# EAGLE design arduino_due_v.1 (EAGLE 8.2.0)
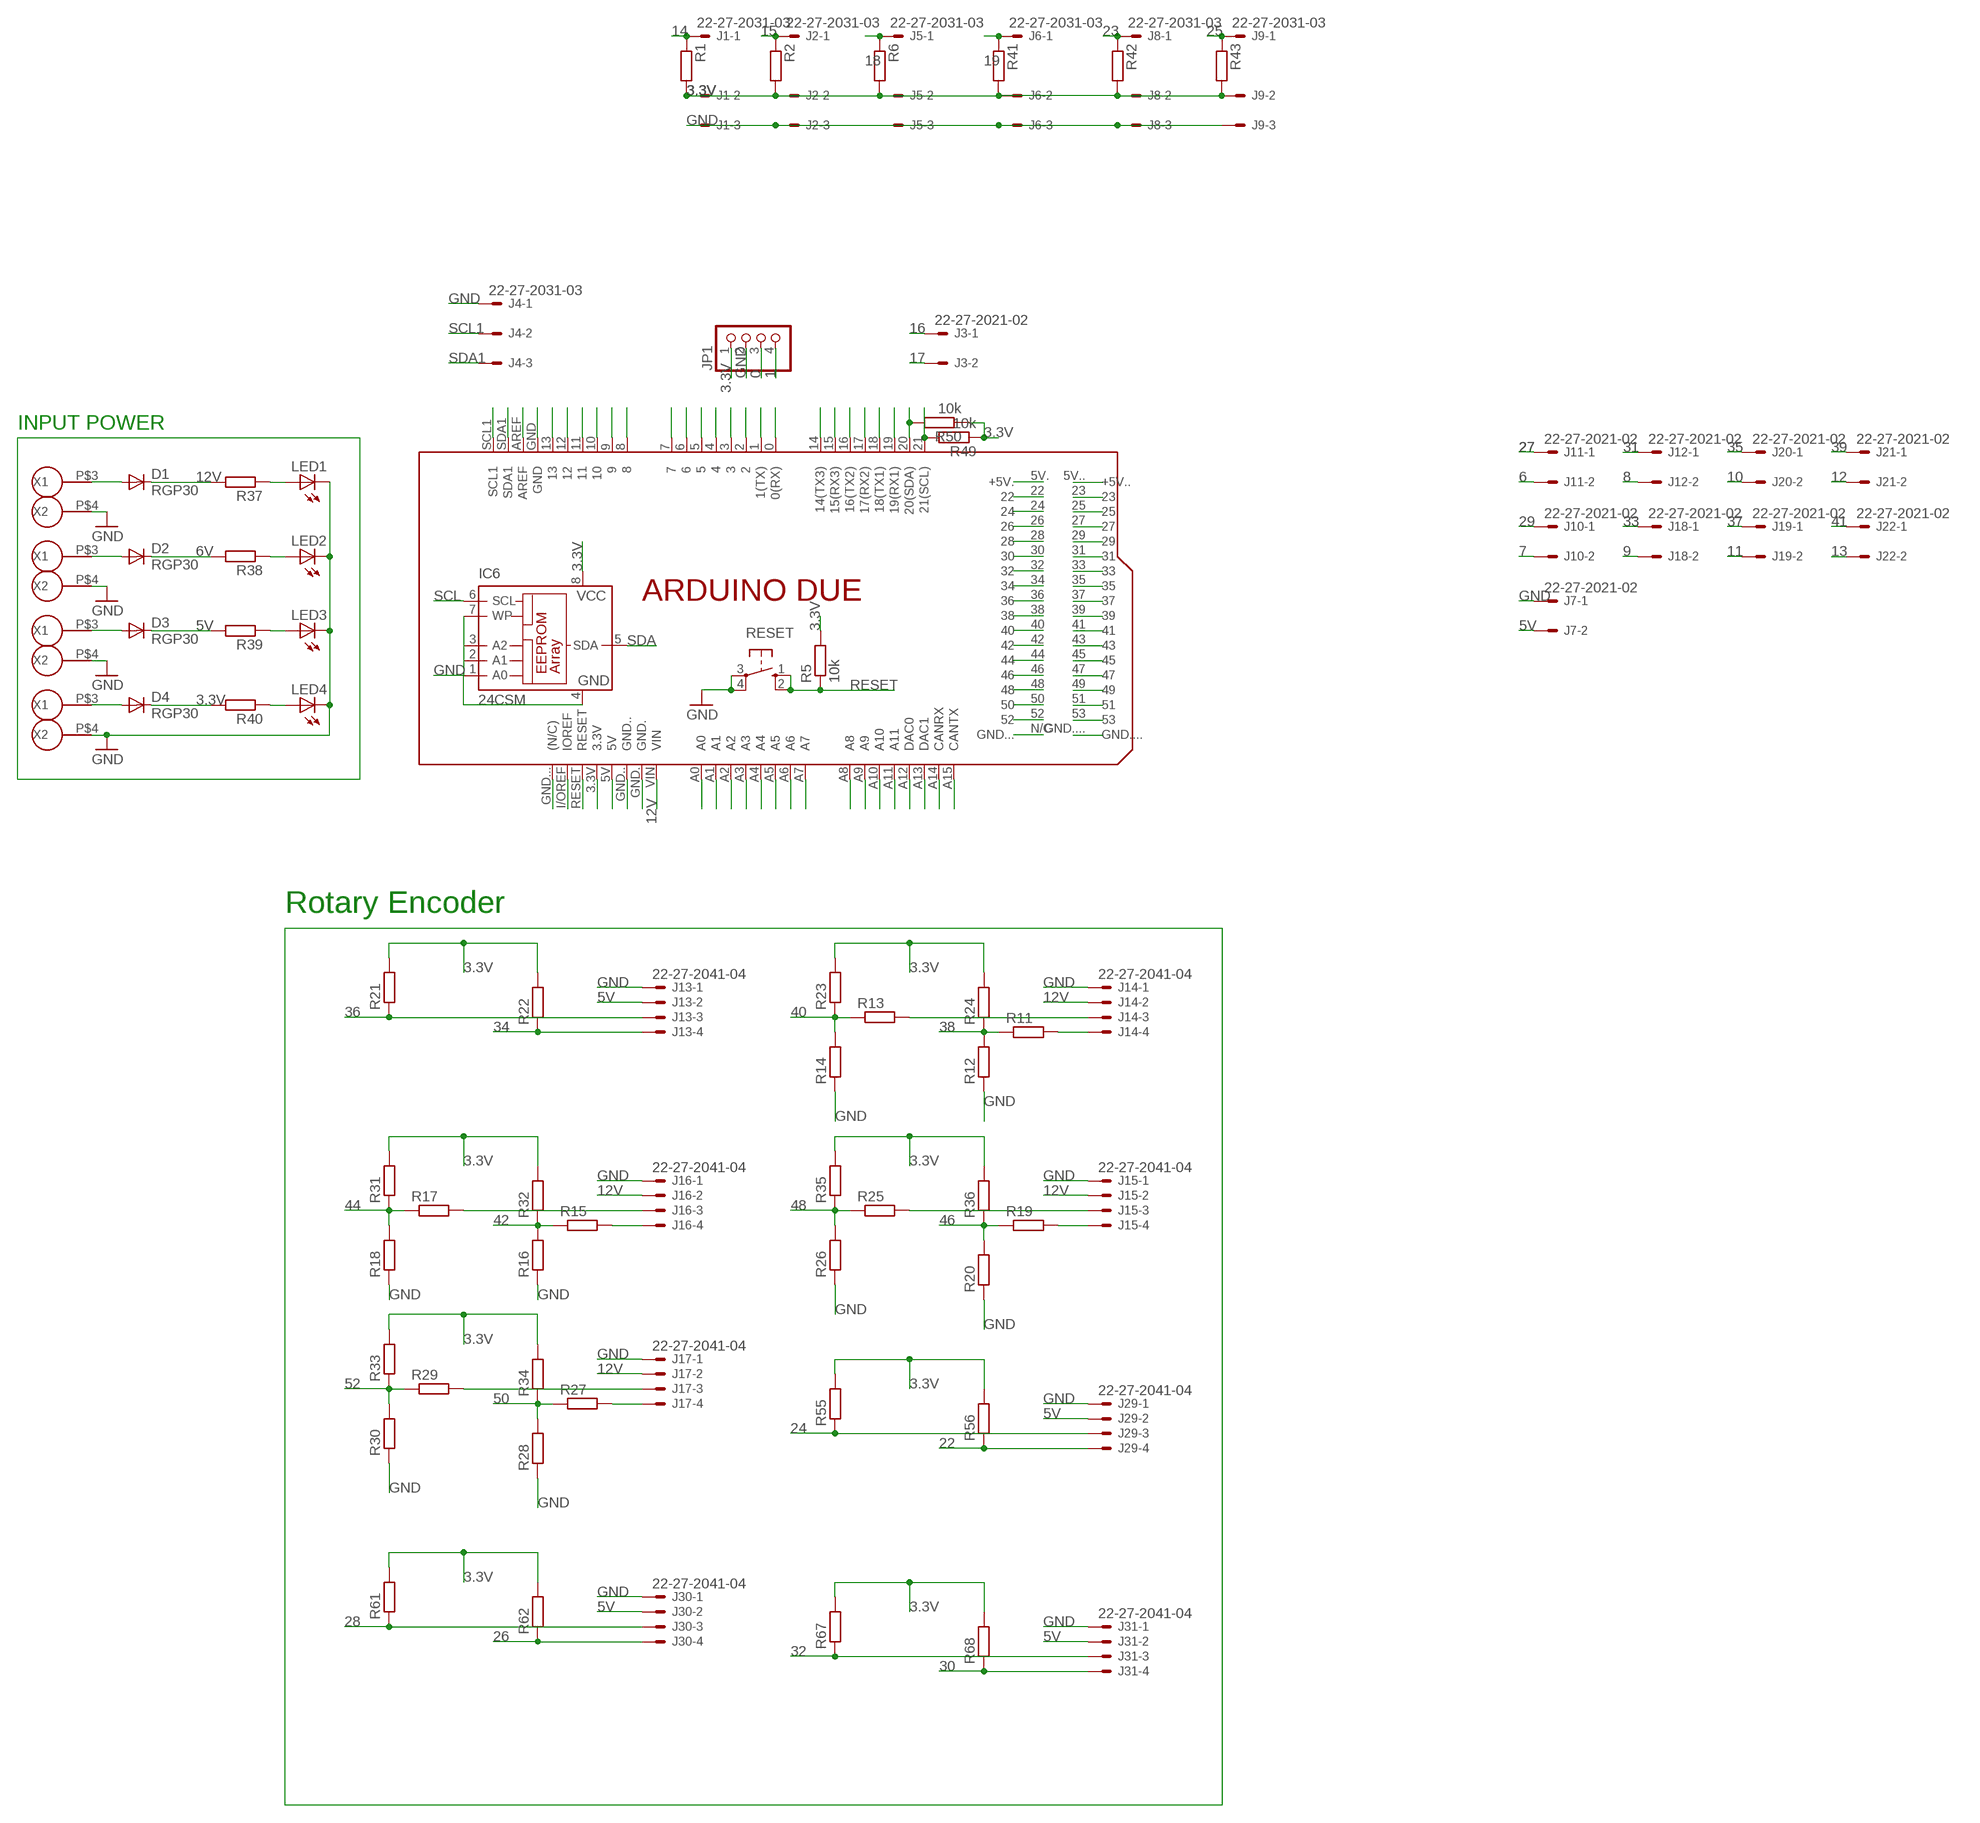
[diagram p0: schematic, sheet 1]

## Parts
D1  RGP30  [DO201-15]
D2  RGP30  [DO201-15]
D3  RGP30  [DO201-15]
D4  RGP30  [DO201-15]
IC6  24CSM  24C02CSM  [SO-08M]
J1  22-27-2031-03  [6410-03]
J2  22-27-2031-03  [6410-03]
J3  22-27-2021-02  [6410-02]
J4  22-27-2031-03  [6410-03]
J5  22-27-2031-03  [6410-03]
J6  22-27-2031-03  [6410-03]
J7  22-27-2021-02  [6410-02]
J8  22-27-2031-03  [6410-03]
J9  22-27-2031-03  [6410-03]
J10  22-27-2021-02  [6410-02]
J11  22-27-2021-02  [6410-02]
J12  22-27-2021-02  [6410-02]
J13  22-27-2041-04  [6410-04]
J14  22-27-2041-04  [6410-04]
J15  22-27-2041-04  [6410-04]
J16  22-27-2041-04  [6410-04]
J17  22-27-2041-04  [6410-04]
J18  22-27-2021-02  [6410-02]
J19  22-27-2021-02  [6410-02]
J20  22-27-2021-02  [6410-02]
J21  22-27-2021-02  [6410-02]
J22  22-27-2021-02  [6410-02]
J29  22-27-2041-04  [6410-04]
J30  22-27-2041-04  [6410-04]
J31  22-27-2041-04  [6410-04]
JP1  PINHD-1X4  [1X04]
LED1  LED3MM  [LED3MM]
LED2  LED3MM  [LED3MM]
LED3  LED3MM  [LED3MM]
LED4  LED3MM  [LED3MM]
PCB1  ARDUINO_DUE  [ARDUINO_DUE]
R1  R-EU_M0805  [M0805]
R2  R-EU_M0805  [M0805]
R5  10k  R-EU_M0805  [M0805]
R6  R-EU_M0805  [M0805]
R11  R-EU_M0805  [M0805]
R12  R-EU_M0805  [M0805]
R13  R-EU_M0805  [M0805]
R14  R-EU_M0805  [M0805]
R15  R-EU_M0805  [M0805]
R16  R-EU_M0805  [M0805]
R17  R-EU_M0805  [M0805]
R18  R-EU_M0805  [M0805]
R19  R-EU_M0805  [M0805]
R20  R-EU_M0805  [M0805]
R21  R-EU_M0805  [M0805]
R22  R-EU_M0805  [M0805]
R23  R-EU_M0805  [M0805]
R24  R-EU_M0805  [M0805]
R25  R-EU_M0805  [M0805]
R26  R-EU_M0805  [M0805]
R27  R-EU_M0805  [M0805]
R28  R-EU_M0805  [M0805]
R29  R-EU_M0805  [M0805]
R30  R-EU_M0805  [M0805]
R31  R-EU_M0805  [M0805]
R32  R-EU_M0805  [M0805]
R33  R-EU_M0805  [M0805]
R34  R-EU_M0805  [M0805]
R35  R-EU_M0805  [M0805]
R36  R-EU_M0805  [M0805]
R37  R-EU_M0805  [M0805]
R38  R-EU_M0805  [M0805]
R39  R-EU_M0805  [M0805]
R40  R-EU_M0805  [M0805]
R41  R-EU_M0805  [M0805]
R42  R-EU_M0805  [M0805]
R43  R-EU_M0805  [M0805]
R49  10k  R-EU_M0805  [M0805]
R50  10k  R-EU_M0805  [M0805]
R55  R-EU_M0805  [M0805]
R56  R-EU_M0805  [M0805]
R61  R-EU_M0805  [M0805]
R62  R-EU_M0805  [M0805]
R67  R-EU_M0805  [M0805]
R68  R-EU_M0805  [M0805]
RESET  40-XX  [B3F-40XX]
U$1  TB9.5  [TB9.5]
U$2  TB9.5  [TB9.5]
U$3  TB9.5  [TB9.5]
U$8  TB9.5  [TB9.5]

## Nets
0: JP1.3 PCB1.0(0(RX))
1: JP1.4 PCB1.1(1(TX))
2: PCB1.2
3: PCB1.3
3.3V: D4.C IC6.8(VCC) J1.2 J2.2 J5.2 J6.2 J8.2 J9.2 JP1.1 R1.2 R2.2 R5.2 R6.2 R21.2 R22.2 R23.2 R24.2 R31.2 R32.2 R33.2 R34.2 R35.2 R36.2 R40.2 R41.2 R42.2 R43.2 R49.1 R50.1 R55.2 R56.2 R61.2 R62.2 R67.2 R68.2
4: PCB1.4
5: PCB1.5
5V: D3.C J7.2 J13.2 J29.2 J30.2 J31.2 R39.2
6: J11.2 PCB1.6
6V: D2.C R38.2
7: J10.2 PCB1.7
8: J12.2 PCB1.8
9: J18.2 PCB1.9
10: J20.2 PCB1.10
11: J19.2 PCB1.11
12: J21.2 PCB1.12
12V: D1.C J14.2 J15.2 J16.2 J17.2 PCB1.VIN R37.2
13: J22.2 PCB1.13
14: J1.1 PCB1.14(14(TX3)) R1.1
15: J2.1 PCB1.15(15(RX3)) R2.1
16: J3.1 PCB1.16(16(TX2))
17: J3.2 PCB1.17(17(RX2))
18: J5.1 PCB1.18(18(TX1)) R6.1
19: J6.1 PCB1.19(19(RX1)) R41.1
22: J29.4 PCB1.22 R56.1
23: J8.1 PCB1.23 R42.1
24: J29.3 PCB1.24 R55.1
25: J9.1 PCB1.25 R43.1
26: J30.4 PCB1.26 R62.1
27: J11.1 PCB1.27
28: J30.3 PCB1.28 R61.1
29: J10.1 PCB1.29
30: J31.4 PCB1.30 R68.1
31: J12.1 PCB1.31
32: J31.3 PCB1.32 R67.1
33: J18.1 PCB1.33
34: J13.4 PCB1.34 R22.1
35: J20.1 PCB1.35
36: J13.3 PCB1.36 R21.1
37: J19.1 PCB1.37
38: PCB1.38 R11.1 R12.2 R24.1
39: J21.1 PCB1.39
40: PCB1.40 R13.1 R14.2 R23.1
41: J22.1 PCB1.41
42: PCB1.42 R15.1 R16.2 R32.1
43: PCB1.43
44: PCB1.44 R17.1 R18.2 R31.1
45: PCB1.45
46: PCB1.46 R19.1 R20.2 R36.1
47: PCB1.47
48: PCB1.48 R25.1 R26.2 R35.1
49: PCB1.49
50: PCB1.50 R27.1 R28.2 R34.1
51: PCB1.51
52: PCB1.52 R29.1 R30.2 R33.1
53: PCB1.53
A0: PCB1.A0
A1: PCB1.A1
A2: PCB1.A2
A3: PCB1.A3
A4: PCB1.A4
A5: PCB1.A5
A6: PCB1.A6
A7: PCB1.A7
A8: PCB1.A8
A9: PCB1.A9
A10: PCB1.A10
A11: PCB1.A11
A12: PCB1.A12(DAC0)
A13: PCB1.A13(DAC1)
A14: PCB1.A14(CANRX)
A15: PCB1.A15(CANTX)
AREF: PCB1.AREF
GND: IC6.1(A0) IC6.2(A1) IC6.3(A2) IC6.4(GND) IC6.7(WP) J1.3 J2.3 J4.1 J5.3 J6.3 J7.1 J8.3 J9.3 J13.1 J14.1 J15.1 J16.1 J17.1 J29.1 J30.1 J31.1 JP1.2 LED1.K(C) LED2.K(C) LED3.K(C) LED4.K(C) PCB1.GND R12.1 R14.1 R16.1 R18.1 R20.1 R26.1 R28.1 R30.1 RESET.3(P) RESET.4(P1) U$1.P$4(X2) U$2.P$4(X2) U$3.P$4(X2) U$8.P$4(X2)
N$8: LED1.A R37.1
N$9: LED2.A R38.1
N$11: J14.4 R11.2
N$12: J14.3 R13.2
N$13: D1.A U$8.P$3(X1)
N$14: D2.A U$1.P$3(X1)
N$15: J16.4 R15.2
N$16: J16.3 R17.2
N$17: J15.4 R19.2
N$18: J15.3 R25.2
N$19: J17.4 R27.2
N$20: J17.3 R29.2
N$21: D3.A U$2.P$3(X1)
N$22: D4.A U$3.P$3(X1)
N$25: LED3.A R39.1
N$30: PCB1.5V.(+5V.)
N$42: LED4.A R40.1
N$47: PCB1.N/C(GND...)
N$48: PCB1.GND....
N$65: PCB1.5V..(+5V..)
N$66: PCB1.GND...((N/C))
N$67: PCB1.I/OREF(IOREF)
N$69: PCB1.3.3V
N$70: PCB1.5V
N$71: PCB1.GND..
N$72: PCB1.GND.
RESET: PCB1.RESET R5.1 RESET.1(S) RESET.2(S1)
SCL: IC6.6(SCL) PCB1.21(21(SCL)) R49.2
SCL1: J4.2 PCB1.SCL1
SDA: IC6.5(SDA) PCB1.20(20(SDA)) R50.2
SDA1: J4.3 PCB1.SDA1

## Notes on the sheet
- INPUT POWER
- Rotary Encoder

## Library data of the parts
D1-D4 = diode:RGP30: DIODE fast-recovery rectifier
IC6 = microchip:24C*: Serial EEPROM 1 K/2 K/4 K; MPN: AT24C04BN-SH-B; OC_FARNELL: 1362643; OC_NEWARK: 50M3316
J1 J2 J4-J6 J8 J9 = con-molex:22-?-03: CONNECTOR wire to board 2.54 mm (.1 inch) pitch header; OC_FARNELL: unknown; OC_NEWARK: unknown
J3 J7 J10-J12 J18-J22 = con-molex:22-?-02: CONNECTOR wire to board 2.54 mm (.1 inch) pitch header; OC_FARNELL: unknown; OC_NEWARK: unknown
J13-J17 J29-J31 = con-molex:22-?-04: CONNECTOR wire to board 2.54 mm (.1 inch) pitch header; OC_FARNELL: unknown; OC_NEWARK: unknown
JP1 = pinhead:PINHD-1X4: PIN HEADER
LED1-LED4 = led:LED: LED OSRAM: - CHIPLED LG R971, LG N971, LY N971, LG Q971, LY Q971, LO R971, LY R971 LH N974, LH R974 LS Q976, LO Q976, LY Q976 LO Q996 - Hyper CHIPLED LW Q18S LB Q993, LB Q99A, LB R99A - SideLED LS A670, LO A670, LY A670, LG A670, LP A670 LB A673, LV A673, LT A673, LW A673 LH A674 LY A675 LS A676, LA A676, LO A676, LY A676, LW A676 LS A679, LY A679, LG A679 - Hyper Micro SIDELED® LS Y876, LA Y876, LO Y876, LY Y876 LT Y87S - SmartLED LW L88C, LW L88S LB L89C, LB L89S, LG L890 LS L89K, LO L89K, LY L89K LS L896, LA L896, LO L896, LY L896 - TOPLED LS T670, LO T670, LY T670, LG T670, LP T670 LSG T670, LSP T670, LSY T670, LOP T670, LYG T670 LG T671, LOG T671, LSG T671 LB T673, LV T673, LT T673, LW T673 LH T674 LS T676, LA T676, LO T676, LY T676, LB T676, LH T676, LSB T676, LW T676 LB T67C, LV T67C, LT T67C, LS T67K, LO T67K, LY T67K, LW E67C LS E67B, LA E67B, LO E67B, LY E67B, LB E67C, LV E67C, LT E67C LW T67C LS T679, LY T679, LG T679 LS T770, LO T770, LY T770, LG T770, LP T770 LB T773, LV T773, LT T773, LW T773 LH T774 LS E675, LA E675, LY E675, LS T675 LS T776, LA T776, LO T776, LY T776, LB T776 LHGB T686 LT T68C, LB T68C - Hyper Mini TOPLED® LB M676 - Mini TOPLED Santana® LG M470 LS M47K, LO M47K, LY M47K Source: http://www.osram.convergy.de LUXEON: - LUMILED® LXK2-PW12-R00, LXK2-PW12-S00, LXK2-PW14-U00, LXK2-PW14-V00 LXK2-PM12-R00, LXK2-PM12-S00, LXK2-PM14-U00 LXK2-PE12-Q00, LXK2-PE12-R00, LXK2-PE12-S00, LXK2-PE14-T00, LXK2-PE14-U00 LXK2-PB12-K00, LXK2-PB12-L00, LXK2-PB12-M00, LXK2-PB14-N00, LXK2-PB14-P00, LXK2-PB14-Q00 LXK2-PR12-L00, LXK2-PR12-M00, LXK2-PR14-Q00, LXK2-PR14-R00 LXK2-PD12-Q00, LXK2-PD12-R00, LXK2-PD12-S00 LXK2-PH12-R00, LXK2-PH12-S00 LXK2-PL12-P00, LXK2-PL12-Q00, LXK2-PL12-R00 Source: www.luxeon.com KINGBRIGHT: KA-3528ASYC Source: www.kingbright.com
PCB1 = E14_Arduino_revC:ARDUINO_DUE: Device for representing an Arduino Due board with a footprint in an EAGLE design. Created by Dave Young for Element14. More EAGLE documentation at: http://www.element14.com/community/community/knode/cadsoft_eagle
R1 R2 R5 R6 R11-R43 R49 R50 R55 R56 R61 R62 R67 R68 = rcl:R-EU_: RESISTOR, European symbol
RESET = switch-omron:40-XX: OMRON SWITCH; MF: OMRON COMPONENTS USA; MPN: B3F-4000; OC_FARNELL: 176434; OC_NEWARK: 36K3105
U$1-U$3 U$8 = TB9.5:TB9.5

## Net classes
2 gnd: width 0.305 mm, drill 0.711 mm, clearance 0.203 mm

## Board
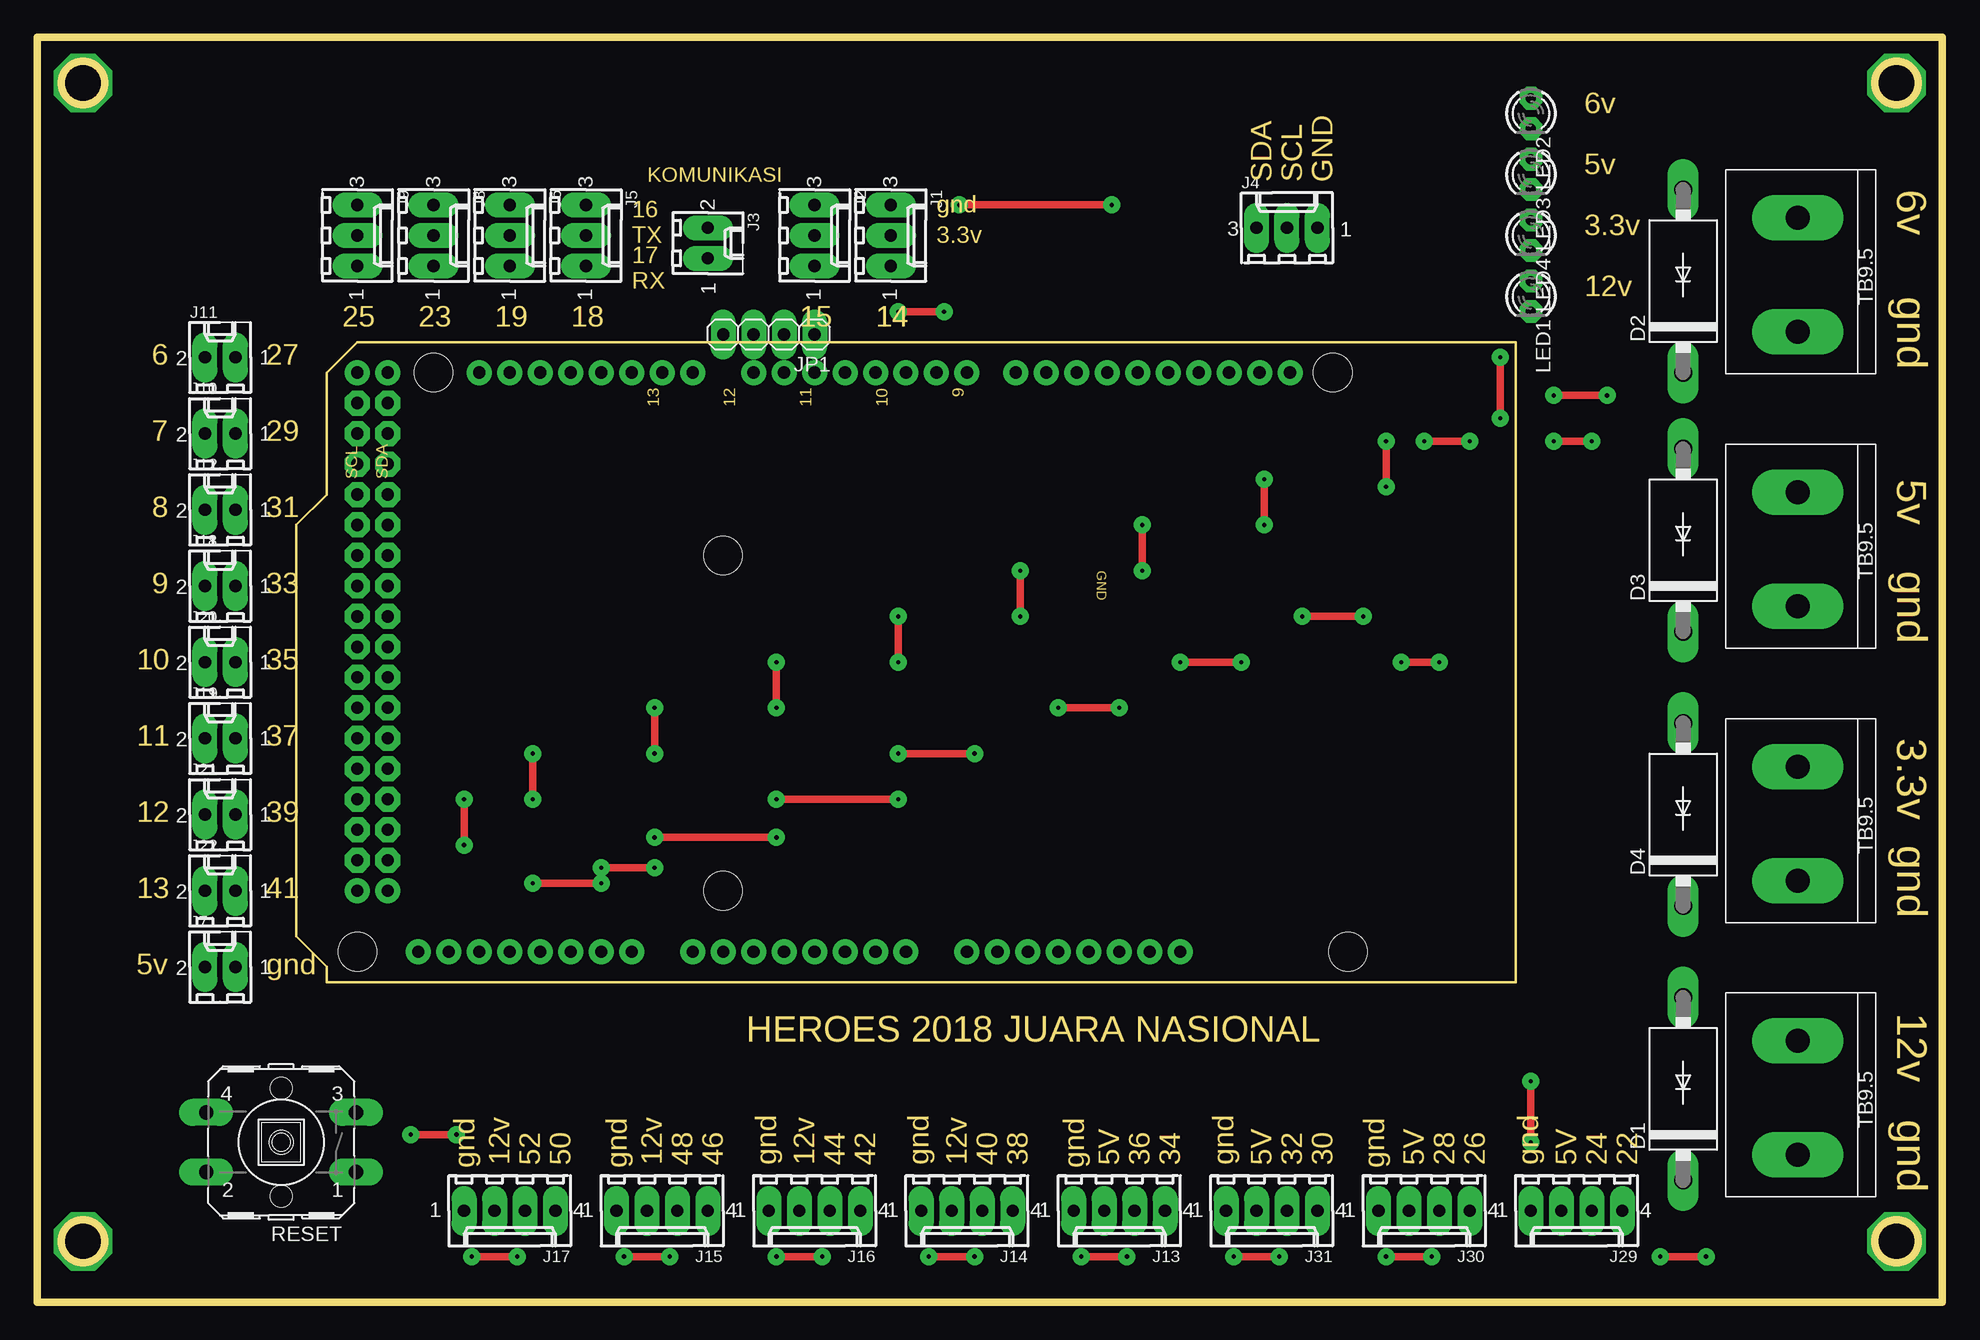
[diagram p1: board, top side]
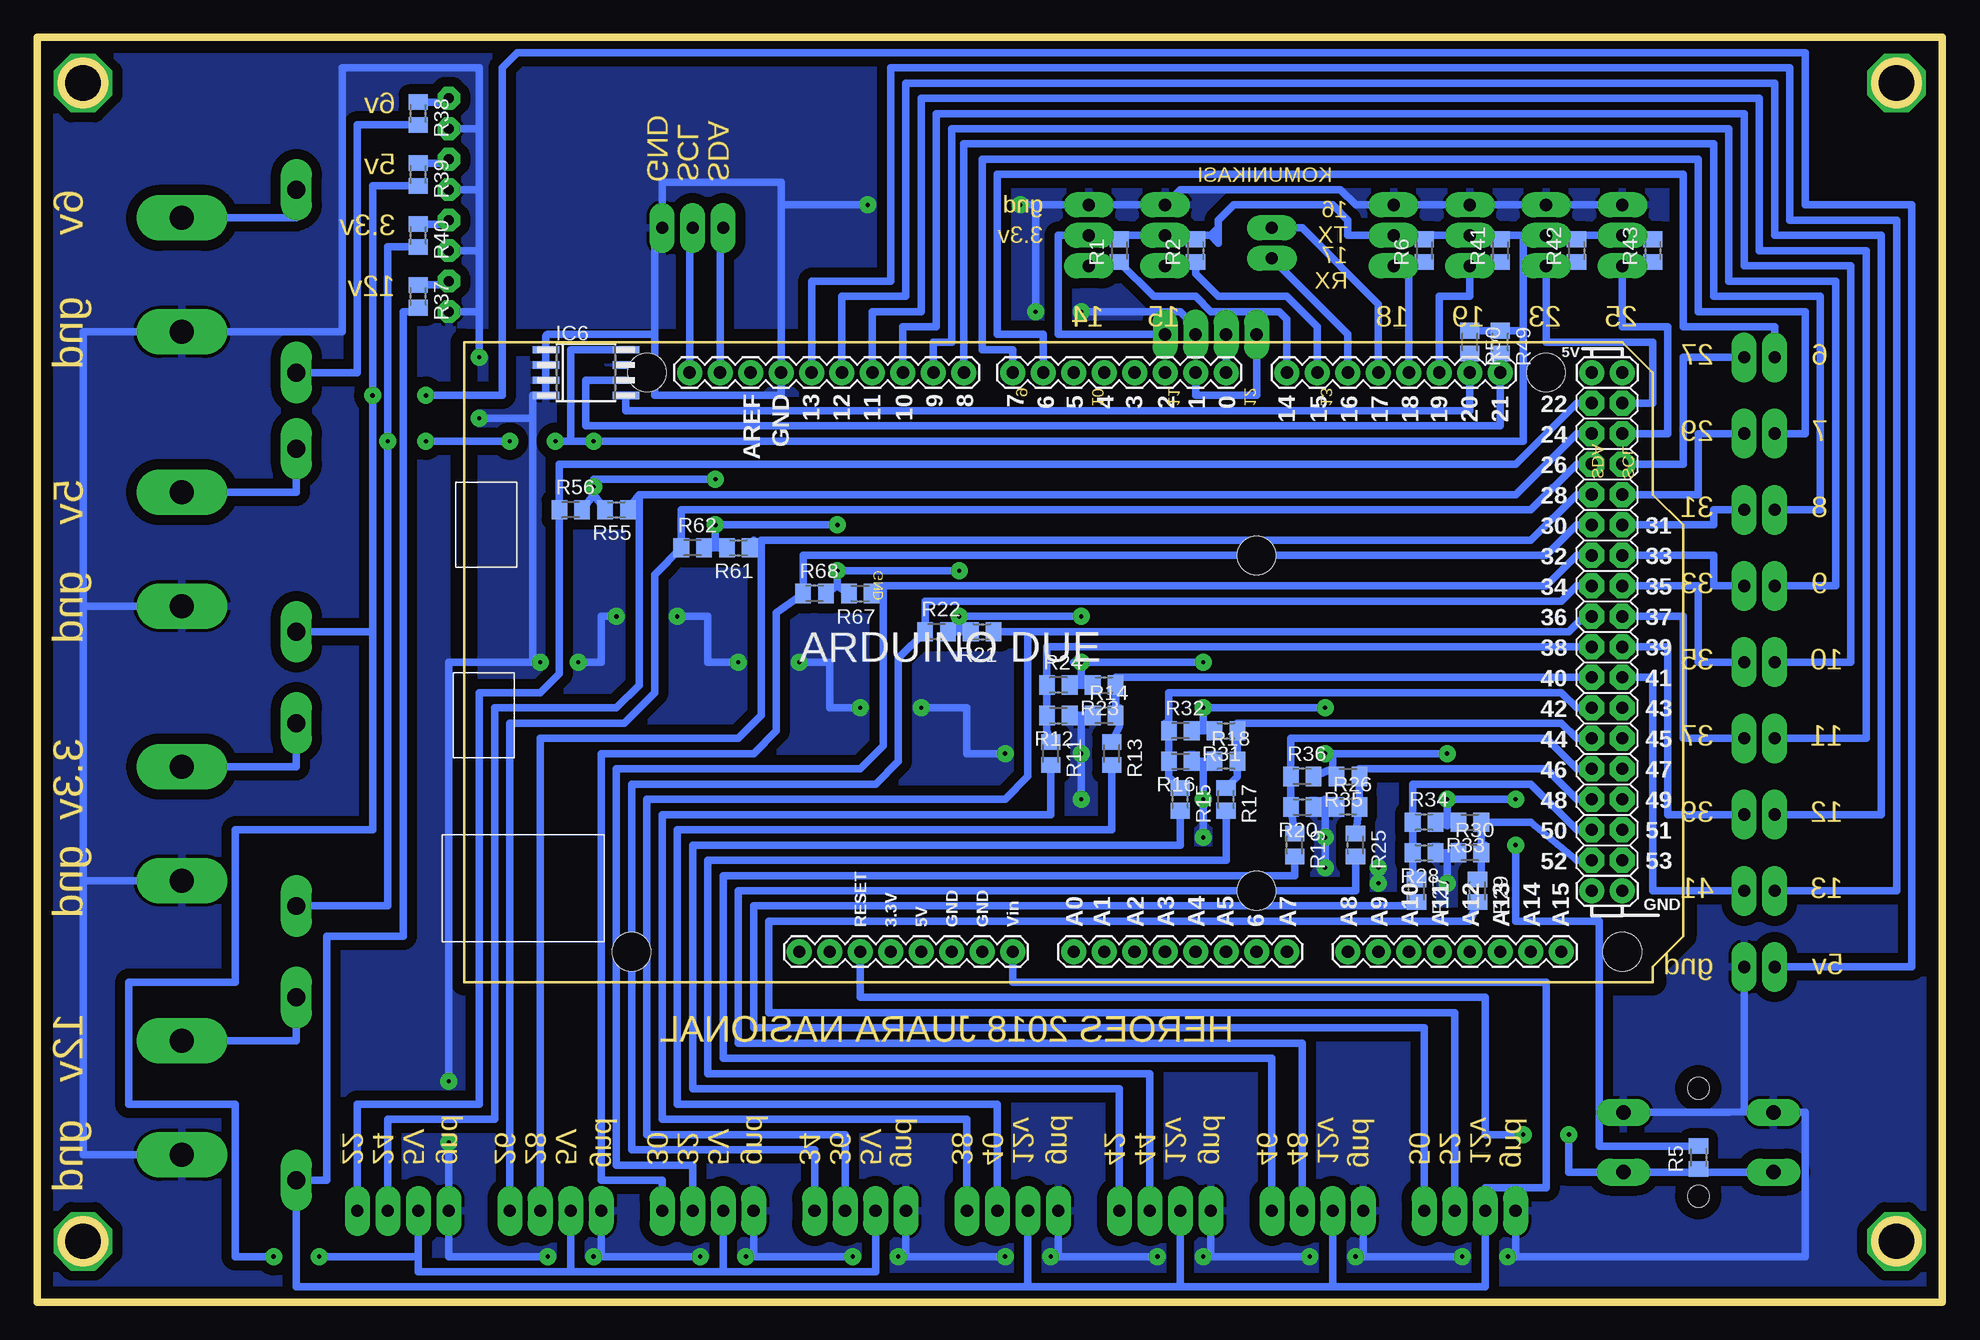
[diagram p2: board, bottom side, seen from below]

Size 158.75 x 105.41 mm. Coordinates in mm from the lower left corner, seen from the top.
Outline: 0,105.41 158.75,105.41 158.75,0 0,0 0,105.41
Outline: circle at 3.81,101.6 radius 1.8
Outline: circle at 154.94,101.6 radius 1.8
Outline: circle at 154.94,5.08 radius 1.8
Outline: circle at 3.81,5.08 radius 1.8
Copper layers (1*16): Top 0.035mm / dielectric 1.5mm / Bottom 0.035mm
Design rules "default *": minimum track width 6mil, minimum drill 0.35mm, track to track 6mil, track to pad 6mil, pad to pad 6mil, via to via 6mil, smd to smd 6mil, copper to edge 40mil, drill to drill 6mil, minimum pad ring 21mil, minimum via ring 21mil, stop-mask expansion 4mil, vias tented up to drill 0mil, thermal gap 10mil

### Footprints (pad centres in the part's own frame; a part is rotated, then mirrored left to right if it is on the bottom)
DO201-15 = drill 1.499 long: A 7.62,0; C -7.62,0
SO-08M = smd 0.6 x 2.2: 1 -1.905,-3.33; 2 -0.635,-3.33; 3 0.635,-3.33; 4 1.905,-3.33; 5 1.905,3.33; 6 0.635,3.33; 7 -0.635,3.33; 8 -1.905,3.33
6410-03 = drill 1.016 long: 1 2.54,0; 2 0,0; 3 -2.54,0
6410-02 = drill 1.016 long: 1 1.27,0; 2 -1.27,0
6410-04 = drill 1.016 long: 1 3.81,0; 2 1.27,0; 3 -1.27,0; 4 -3.81,0
1X04 = drill 1.016 long: 1 -3.81,0; 2 -1.27,0; 3 1.27,0; 4 3.81,0
LED3MM = drill 0.813 octagon: A -1.27,0; K 1.27,0
ARDUINO_DUE = drill 1.016 pad 1.88: 0 63.5,50.8; 1 60.96,50.8; 2 58.42,50.8; 3 55.88,50.8; 3.3V 35.56,2.54; 4 53.34,50.8; 5 50.8,50.8; 5V 38.1,2.54; 5V. 93.98,50.8; 5V.. 96.52,50.8; 6 48.26,50.8; 7 45.72,50.8; 8 41.656,50.8; 9 39.116,50.8; 10 36.576,50.8; 11 34.036,50.8; 12 31.496,50.8; 13 28.956,50.8; 14 68.58,50.8; 15 71.12,50.8; 16 73.66,50.8; 17 76.2,50.8; 18 78.74,50.8; 19 81.28,50.8; 20 83.82,50.8; 21 86.36,50.8; A0 50.8,2.54; A1 53.34,2.54; A2 55.88,2.54; A3 58.42,2.54; A4 60.96,2.54; A5 63.5,2.54; A6 66.04,2.54; A7 68.58,2.54; A8 73.66,2.54; A9 76.2,2.54; A10 78.74,2.54; A11 81.28,2.54; A12 83.82,2.54; A13 86.36,2.54; A14 88.9,2.54; A15 91.44,2.54; AREF 23.876,50.8; GND 26.416,50.8; GND. 43.18,2.54; GND.. 40.64,2.54; GND... 93.98,7.62; GND.... 96.52,7.62; I/OREF 30.48,2.54; N/C 27.94,2.54; RESET 33.02,2.54; SCL1 18.796,50.8; SDA1 21.336,50.8; VIN 45.72,2.54 | drill 1.016 pad 1.88 octagon: 22 93.98,48.26; 23 96.52,48.26; 24 93.98,45.72; 25 96.52,45.72; 26 93.98,43.18; 27 96.52,43.18; 28 93.98,40.64; 29 96.52,40.64; 30 93.98,38.1; 31 96.52,38.1; 32 93.98,35.56; 33 96.52,35.56; 34 93.98,33.02; 35 96.52,33.02; 36 93.98,30.48; 37 96.52,30.48; 38 93.98,27.94; 39 96.52,27.94; 40 93.98,25.4; 41 96.52,25.4; 42 93.98,22.86; 43 96.52,22.86; 44 93.98,20.32; 45 96.52,20.32; 46 93.98,17.78; 47 96.52,17.78; 48 93.98,15.24; 49 96.52,15.24; 50 93.98,12.7; 51 96.52,12.7; 52 93.98,10.16; 53 96.52,10.16 | hole 3.2: 15.24,50.8; 13.97,2.54; 66.04,35.56; 66.04,7.62; 90.17,50.8; 96.52,2.54
M0805 = smd 1.3 x 1.6: 1 -0.95,0; 2 0.95,0
B3F-40XX = drill 1.194 long: 1 -6.248,2.489; 2 6.248,2.489; 3 -6.248,-2.489; 4 6.248,-2.489 | hole 1.803: 0,-4.496; 0,4.496
TB9.5 = drill 2 pad 3.81 long: P$3 -4,7; P$4 5.5,7

### Placement (x,y rotation side)
D1  137.16,17.78 90 top
D2  137.16,85.09 90 top
D3  137.16,63.5 90 top
D4  137.16,40.64 90 top
IC6  113.03,77.47 270 bottom
J1  71.12,88.9 270 top
J2  64.77,88.9 270 top
J3  55.88,88.26 270 top
J4  104.14,89.53 0 top
J5  45.72,88.9 270 top
J6  39.37,88.9 270 top
J7  15.24,27.94 0 top
J8  33.02,88.9 270 top
J9  26.67,88.9 270 top
J10  15.24,72.39 0 top
J11  15.24,78.74 0 top
J12  15.24,66.04 0 top
J13  90.17,7.62 180 top
J14  77.47,7.62 180 top
J15  52.07,7.62 180 top
J16  64.77,7.62 180 top
J17  39.37,7.62 180 top
J18  15.24,59.69 0 top
J19  15.24,46.99 0 top
J20  15.24,53.34 0 top
J21  15.24,40.64 0 top
J22  15.24,34.29 0 top
J29  128.27,7.62 180 top
J30  115.57,7.62 180 top
J31  102.87,7.62 180 top
JP1  60.96,80.65 180 top
LED1  124.46,83.82 270 top
LED2  124.46,99.06 270 top
LED3  124.46,93.98 270 top
LED4  124.46,88.9 270 top
PCB1  123.19,26.67 0 bottom
R1  68.58,87.63 90 bottom
R2  62.23,87.63 90 bottom
R5  20.32,12.06 90 bottom
R6  43.18,87.63 90 bottom
R11  74.3,45.72 270 bottom
R12  73.66,48.9 180 bottom
R13  69.22,45.72 270 bottom
R14  69.85,48.9 0 bottom
R15  63.5,41.91 270 bottom
R16  63.5,45.09 180 bottom
R17  59.69,41.91 270 bottom
R18  59.69,45.09 0 bottom
R19  53.97,38.1 270 bottom
R20  53.34,41.27 180 bottom
R21  80.01,55.88 180 bottom
R22  83.82,55.88 0 bottom
R23  69.85,51.43 180 bottom
R24  73.66,51.43 0 bottom
R25  48.9,38.1 270 bottom
R26  49.53,41.27 0 bottom
R27  43.81,34.29 270 bottom
R28  43.18,37.46 180 bottom
R29  38.74,34.29 270 bottom
R30  39.37,37.46 0 bottom
R31  59.69,47.62 180 bottom
R32  63.5,47.62 0 bottom
R33  39.37,40.01 180 bottom
R34  43.18,40.01 0 bottom
R35  49.53,43.82 180 bottom
R36  53.34,43.82 0 bottom
R37  127,83.82 270 bottom
R38  127,99.06 270 bottom
R39  127,93.98 270 bottom
R40  127,88.9 270 bottom
R41  36.83,87.63 90 bottom
R42  30.48,87.63 90 bottom
R43  24.13,87.63 90 bottom
R49  36.83,80.01 270 bottom
R50  39.37,80.01 270 bottom
R55  110.49,66.04 180 bottom
R56  114.3,66.04 0 bottom
R61  100.33,62.87 180 bottom
R62  104.14,62.87 0 bottom
R67  90.17,59.05 180 bottom
R68  93.98,59.05 0 bottom
RESET  20.32,13.34 180 top
U$1  139.7,86.36 270 top
U$2  139.7,63.5 270 top
U$3  139.7,40.64 270 top
U$8  139.7,17.78 270 top

### Tracks (layer width: path | path; a pad name or v marks a point on that pad's centre or on a via)
0
  Bottom 0.61: PCB1.0 JP1.3
1
  Bottom 0.61: PCB1.1 62.23,75.56 57.15,75.56 JP1.4
3.3V  (via drill 0.35)
  Top 0.61: v41.28,41.91 v41.28,45.72 | v51.44,45.72 v51.44,49.53 | v61.59,49.53 v61.59,53.34 | v71.76,53.34 v71.76,57.15 | v81.92,57.15 v81.92,60.96 | v92.08,60.96 v92.08,64.77 | v102.23,64.77 v102.23,68.58 | v112.4,67.94 v112.4,71.75 | v35.56,38.1 v35.56,41.91 | v129.54,71.75 v126.37,71.75 | v119.38,71.75 v115.57,71.75
  Bottom 0.61: R43.2 24.13,88.9 J9.2 30.48,88.9 | 30.48,88.9 J8.2 34.93,88.9 | 34.93,88.9 36.83,88.9 | 36.83,88.9 J6.2 43.18,88.9 | 43.18,88.9 J5.2 49.53,88.9 49.53,90.17 50.8,91.44 59.06,91.44 60.33,90.17 60.33,89.53 | R6.2 43.18,88.9 | R41.2 36.83,88.9 | R42.2 30.48,88.9 | R50.1 R49.1 34.93,80.96 | 34.93,80.96 34.93,88.9 | R33.2 R34.2 41.28,39.69 v41.28,41.91 v35.56,41.91 | 50.8,44.45 R35.2 | 50.8,44.45 R36.2 | 50.8,45.72 50.8,44.45 | 61.59,47.62 R31.2 | 61.59,47.62 R32.2 | R23.2 71.76,51.43 | 71.76,51.43 R24.2 | 81.92,55.88 R22.2 | 81.92,55.88 R21.2 | 92.08,59.69 R68.2 | 92.08,59.69 R67.2 | 102.23,62.87 R62.2 | 102.23,62.87 R61.2 | 112.4,67.31 R55.2 | 112.4,67.31 R56.2 | D4.C 129.54,33.02 v129.54,71.75 129.54,87.95 R40.2 | v41.28,45.72 50.8,45.72 | 50.8,45.72 v51.44,45.72 | v51.44,49.53 v61.59,49.53 61.59,47.62 | v61.59,53.34 v71.76,53.34 | 71.76,51.43 v71.76,53.34 | v71.76,53.34 72.39,53.34 | 81.92,55.88 v81.92,57.15 v71.76,57.15 | v81.92,60.96 v92.08,60.96 92.08,59.69 | v92.08,64.77 v102.23,64.77 102.23,62.87 | v112.4,67.94 112.4,67.31 | 114.3,71.75 v112.4,71.75 34.93,71.75 34.93,80.96 | IC6.8 114.3,79.38 114.3,71.75 | R5.2 28.58,13.02 28.58,31.75 35.56,31.75 v35.56,38.1 | v126.37,71.75 v119.38,71.75 | v115.57,71.75 114.3,71.75 | JP1.1 73.66,80.65 73.66,88.9 72.39,88.9 | v102.23,68.58 112.4,68.58 112.4,67.31 | 62.23,88.9 J2.2 68.58,88.9 | 70.48,88.9 68.58,88.9 | 70.48,88.9 J1.2 | R1.2 68.58,88.9 | R2.2 62.23,88.9 | 60.96,88.9 60.33,89.53 | 60.96,88.9 62.23,88.9 | 60.33,89.53 60.33,88.26 60.96,88.9 | 72.39,88.9 70.48,88.9 | 70.48,88.9 69.85,88.9 | J1.2 72.39,88.9 | J1.2 70.48,88.9 | J1.2 70.48,88.9
5V  (via drill 0.35)
  Top 0.61: v135.25,3.81 v139.06,3.81 | v126.37,75.56 v130.81,75.56
  Bottom 0.61: R39.2 130.81,93.03 v130.81,75.56 130.81,55.88 | 130.81,55.88 D3.C | J7.2 2.54,27.94 2.54,91.44 11.43,91.44 11.43,104.14 118.75,104.14 120.02,102.87 120.02,75.56 v126.37,75.56 | J13.2 88.9,2.54 101.6,2.54 | J29.2 127,3.81 | 101.6,2.54 114.3,2.54 | 114.3,2.54 127,2.54 127,3.81 | J30.2 114.3,2.54 | J31.2 101.6,2.54 | 127,3.81 v135.25,3.81 | v139.06,3.81 142.24,3.81 142.24,16.51 151.13,16.51 151.13,26.67 142.24,26.67 142.24,39.37 130.81,39.37 130.81,55.88
6
  Bottom 0.61: PCB1.6 74.93,80.65 78.74,80.65 78.74,93.98 21.59,93.98 21.59,81.28 13.97,81.28 J11.2
6V
  Bottom 0.61: R38.2 132.08,98.11 132.08,77.47 D2.C
7
  Bottom 0.61: J10.2 11.43,72.39 11.43,82.55 20.32,82.55 20.32,95.25 80.01,95.25 80.01,79.38 77.47,79.38 PCB1.7
8
  Bottom 0.61: 10.16,66.04 J12.2 10.16,66.04 | PCB1.8 81.53,96.52 19.05,96.52 19.05,83.82 10.16,83.82 10.16,66.04
9
  Bottom 0.61: J18.2 8.89,59.69 8.89,85.09 17.78,85.09 17.78,97.79 20.32,97.79 82.55,97.79 82.55,80.01 84.07,80.01 PCB1.9
10
  Bottom 0.61: J20.2 7.62,53.34 7.62,86.36 16.51,86.36 16.51,99.06 83.82,99.06 83.82,81.28 86.61,81.28 PCB1.10
11
  Bottom 0.61: J19.2 6.35,46.99 6.35,87.63 15.24,87.63 15.24,99.06 | PCB1.11 89.15,82.55 85.09,82.55 85.09,100.33 15.24,100.33 | 15.24,99.06 15.24,100.33 | 15.24,99.06 15.24,97.79 | 15.24,100.33 15.24,99.06
12
  Bottom 0.61: J21.2 5.08,40.64 5.08,88.9 13.97,88.9 13.97,101.6 86.36,101.6 86.36,83.82 91.69,83.82 PCB1.12
12V
  Bottom 0.61: PCB1.VIN 77.47,26.67 33.02,26.67 33.02,9.52 38.1,9.52 J17.2 38.1,1.27 50.8,1.27 | 63.5,1.27 50.8,1.27 | 76.2,1.27 63.5,1.27 | 76.2,1.27 137.16,1.27 D1.C 134.62,10.16 134.62,30.48 128.27,30.48 128.27,82.55 127,82.55 R37.2 | J15.2 50.8,1.27 | J16.2 63.5,1.27 | J14.2 76.2,1.27
13
  Bottom 0.61: J22.2 3.81,34.29 3.81,90.17 12.7,90.17 12.7,96.52 | PCB1.13 94.23,85.09 87.63,85.09 87.63,102.87 20.32,102.87 | 20.32,102.87 21.59,102.87 20.32,102.87 | 20.32,102.87 12.7,102.87 12.7,96.52 | 12.7,96.52 12.7,97.79 12.7,96.52
14
  Bottom 0.61: J1.1 68.58,86.36 R1.1 65.72,83.82 62.23,83.82 60.96,82.55 55.25,82.55 54.61,81.91 PCB1.14
15
  Bottom 0.61: J2.1 62.23,86.36 R2.1 62.23,85.72 60.33,83.82 54.61,83.82 52.07,81.28 PCB1.15
16
  Bottom 0.61: PCB1.16 49.53,80.65 J3.1
17
  Bottom 0.61: PCB1.17 46.99,83.19 53.34,89.53 J3.2
18
  Bottom 0.61: 45.09,86.36 J5.1 | 45.09,86.36 44.45,86.36 PCB1.18 | R6.1 43.18,86.36 45.09,86.36
19
  Bottom 0.61: PCB1.19 41.91,83.82 39.37,83.82 J6.1 36.83,86.36 R41.1
22
  Bottom 0.61: PCB1.22 30.48,74.93 35.56,69.85 115.25,69.85 R56.1 115.25,52.39 116.84,50.8 121.92,50.8 121.92,16.51 132.08,16.51 J29.4
23
  Bottom 0.61: PCB1.23 24.13,74.93 24.13,80.01 33.02,80.01 J8.1 30.48,86.36 R42.1
24
  Bottom 0.61: PCB1.24 30.48,72.39 35.56,67.31 108.59,67.31 | 108.59,67.31 R55.1 | J29.3 129.54,15.24 120.65,15.24 120.65,49.53 110.49,49.53 108.59,51.43 108.59,67.31
25
  Bottom 0.61: PCB1.25 22.86,72.39 22.86,81.28 26.67,81.28 J9.1 24.13,86.36 R43.1
26
  Bottom 0.61: PCB1.26 30.48,69.85 34.29,66.04 105.09,66.04 R62.1 107.32,60.64 107.32,50.8 109.86,48.26 119.38,48.26 J30.4
27
  Bottom 0.61: J11.1 21.59,78.74 21.59,69.85 PCB1.27
28
  Bottom 0.61: 99.06,63.5 R61.1 98.43,63.5 | PCB1.28 30.48,67.31 34.29,63.5 98.43,63.5 | J30.3 116.84,46.99 100.33,46.99 98.43,48.9 98.43,63.5
29
  Bottom 0.61: PCB1.29 20.32,67.31 20.32,72.39 J10.1
30
  Bottom 0.61: PCB1.30 30.48,64.77 33.02,62.23 94.93,62.23 R68.1 97.16,57.46 97.16,47.62 99.06,45.72 111.76,45.72 111.76,10.16 106.68,10.16 J31.4
31
  Bottom 0.61: PCB1.31 19.05,64.77 19.05,66.04 J12.1
32
  Bottom 0.61: 88.27,59.69 33.02,59.69 30.48,62.23 PCB1.32 | 88.27,59.69 R67.1 | J31.3 104.14,11.43 110.49,11.43 110.49,44.45 90.17,44.45 88.27,46.35 88.27,59.69
33
  Bottom 0.61: J18.1 19.05,59.69 19.05,62.23 PCB1.33
34
  Bottom 0.61: PCB1.34 30.48,59.69 31.75,58.42 84.77,58.42 R22.1 87,53.65 87,45.09 88.9,43.18 109.22,43.18 109.22,12.7 93.98,12.7 J13.4
35
  Bottom 0.61: PCB1.35 20.32,59.69 20.32,53.34 J20.1
36
  Bottom 0.61: PCB1.36 29.84,57.15 31.12,55.88 76.2,55.88 | 76.2,55.88 R21.1 | J13.3 91.44,13.97 107.95,13.97 107.95,41.91 78.11,41.91 76.2,43.82 76.2,55.88
37
  Bottom 0.61: J19.1 21.59,46.99 21.59,57.15 PCB1.37
38
  Bottom 0.61: R11.1 74.61,47.62 R12.2 R24.1 74.61,54.61 PCB1.38
39
  Bottom 0.61: J21.1 22.86,40.64 22.86,54.61 PCB1.39
40
  Bottom 0.61: 68.9,50.8 R14.2 68.58,49.53 68.58,47.94 R13.1 | 68.9,50.8 R23.1 | PCB1.40 68.9,52.07 68.9,50.8
41
  Bottom 0.61: J22.1 24.13,34.29 24.13,52.07 PCB1.41
42
  Bottom 0.61: R32.1 64.77,48.26 | R32.1 R16.2 64.45,43.81 R15.1 | PCB1.42 30.48,49.53 31.75,50.8 64.45,50.8 R32.1
44
  Bottom 0.61: 58.74,46.99 R18.2 58.74,43.81 R17.1 | 58.74,46.99 R31.1 | PCB1.44 30.48,46.99 31.75,48.26 58.74,48.26 58.74,46.99
46
  Bottom 0.61: R19.1 R20.2 R36.1 54.29,46.99 33.02,46.99 30.48,44.45 PCB1.46
48
  Bottom 0.61: PCB1.48 30.48,41.91 33.02,44.45 48.58,44.45 R35.1 R26.2 R25.1
50
  Bottom 0.61: R27.1 44.13,35.24 R28.2 R34.1 44.13,43.18 34.29,43.18 30.48,39.37 PCB1.50
52
  Bottom 0.61: R30.2 R33.1 34.29,40.01 30.48,36.83 PCB1.52 | 38.1,38.1 R30.2 | R30.2 38.42,35.24 R29.1
GND  (via drill 0.35)
  Top 0.61: v41.28,34.93 v46.99,34.93 | v46.99,36.2 v51.44,36.2 | v61.59,41.91 v71.76,41.91 | v71.76,45.72 v78.11,45.72 | v85.09,49.53 v90.17,49.53 | v95.25,53.34 v100.33,53.34 | v105.41,57.15 v110.49,57.15 | v51.44,38.73 v61.59,38.73 | v40,3.81 v36.19,3.81 | v48.9,3.81 v52.71,3.81 | v61.59,3.81 v65.41,3.81 | v74.3,3.81 v78.11,3.81 | v113.67,53.34 v116.84,53.34 | v124.46,13.34 v124.46,18.41 | v76.84,91.44 v89.54,91.44 | v71.76,82.55 v75.57,82.55 | v87,3.81 v90.81,3.81 | v99.7,3.81 v103.51,3.81 | v112.4,3.81 v116.21,3.81 | v121.92,78.74 v121.92,73.66
  Bottom 0.61: IC6.2 IC6.1 | J9.3 J8.3 J6.3 J5.3 48.9,91.44 50.16,92.71 63.5,92.71 J2.3 J1.3 75.57,91.44 | IC6.4 IC6.3 IC6.2 | R30.1 41.28,37.46 | 41.28,37.46 R28.1 | 51.44,41.91 R20.1 | 51.44,41.91 R26.1 | 61.59,45.09 R16.1 | 61.59,45.09 R18.1 | 71.76,48.9 R12.1 | 71.76,48.9 R14.1 | U$8.P$4 154.94,12.28 154.94,35.14 | 154.94,58 154.94,35.14 | 154.94,58 154.94,80.86 U$1.P$4 133.35,80.86 133.35,102.87 121.92,102.87 121.92,97.79 | U$3.P$4 154.94,35.14 | U$2.P$4 154.94,58 | LED1.K 121.92,82.55 | 121.92,87.63 121.92,92.71 | 121.92,87.63 121.92,82.55 | 121.92,97.79 121.92,92.71 | 121.92,97.79 LED2.K | LED3.K 121.92,92.71 | LED4.K 121.92,87.63 | RESET.3 17.78,15.82 16.51,15.88 | J7.1 16.51,15.88 | 16.51,15.88 16.61,15.88 RESET.4 11.43,15.82 11.43,3.81 35.56,3.81 | IC6.7 107.32,78.1 | 107.32,78.1 107.32,80.65 | 107.32,80.65 116.21,80.65 arc-90 116.36,80.49 IC6.2 | 41.28,37.46 v41.28,34.93 | v46.99,34.93 v46.99,36.2 | v51.44,36.2 v51.44,38.73 51.44,41.91 | v61.59,38.73 v61.59,41.91 61.59,45.09 | v71.76,41.91 v71.76,45.72 71.76,48.9 | J15.1 48.26,3.81 | 48.26,3.81 v40,3.81 | v36.19,3.81 35.56,3.81 | 35.56,3.81 J17.1 | 48.26,3.81 v48.9,3.81 | 60.96,3.81 J16.1 | v52.71,3.81 60.96,3.81 | 60.96,3.81 v61.59,3.81 | v65.41,3.81 73.66,3.81 | J13.1 86.36,3.81 | J14.1 73.66,3.81 | 73.66,3.81 v74.3,3.81 | v78.11,3.81 86.36,3.81 | 117.48,53.34 v116.84,53.34 | 117.48,73.66 117.48,75.56 IC6.4 | 117.48,73.66 117.48,53.34 | IC6.4 116.21,75.56 | v124.46,13.34 J29.1 124.46,3.81 v116.21,3.81 | v124.46,18.41 124.46,53.34 117.48,53.34 | 96.77,91.44 PCB1.GND 96.77,75.56 107.32,75.56 107.32,78.1 | 96.77,91.44 96.77,93.34 106.68,93.34 J4.1 107.32,89.53 107.32,80.65 | 75.57,91.44 v76.84,91.44
  Bottom 0.61: v89.54,91.44 96.77,91.44 | JP1.2 62.23,81.28 63.5,82.55 v71.76,82.55 | v75.57,82.55 75.57,91.44 | v78.11,45.72 81.28,45.72 81.28,49.53 v85.09,49.53 | v90.17,49.53 92.71,49.53 92.71,53.34 v95.25,53.34 | v100.33,53.34 102.87,53.34 102.87,57.15 v105.41,57.15 | v110.49,57.15 111.76,57.15 111.76,53.34 v113.67,53.34 | 86.36,3.81 v87,3.81 | 99.06,3.81 v90.81,3.81 | 99.06,3.81 v99.7,3.81 | 111.76,3.81 v103.51,3.81 | 111.76,3.81 v112.4,3.81 | J30.1 111.76,3.81 | J31.1 99.06,3.81 | 121.92,82.55 v121.92,78.74 | v121.92,73.66 117.48,73.66
  pour Bottom (isolate 0.838): 158.75,105.41 0,105.41 0,0 158.75,0
N$2
  Bottom 0.61: 0,105.41 158.75,105.41 158.75,0 0,0 0,105.41
N$8
  Bottom 0.61: LED1.A 124.46,84.77 R37.1
N$9
  Bottom 0.61: LED2.A 124.46,100.01 R38.1
N$11
  Bottom 0.61: J14.4 81.28,15.24 106.68,15.24 106.68,40.64 74.3,40.64 R11.2
N$12
  Bottom 0.61: J14.3 78.74,16.51 105.41,16.51 105.41,39.37 69.22,39.37 R13.2
N$13
  Bottom 0.61: D1.A 137.16,21.78 U$8.P$3
N$14
  Bottom 0.61: D2.A 137.16,90.36 U$1.P$3
N$15
  Bottom 0.61: J16.4 68.58,17.78 104.14,17.78 104.14,38.1 63.5,38.1 R15.2
N$16
  Bottom 0.61: R17.2 59.69,36.83 102.87,36.83 102.87,19.05 66.04,19.05 J16.3
N$17
  Bottom 0.61: J15.4 55.88,20.32 101.6,20.32 101.6,35.56 53.97,35.56 R19.2
N$18
  Bottom 0.61: R25.2 48.9,34.29 100.33,34.29 100.33,21.59 53.34,21.59 J15.3
N$19
  Bottom 0.61: R27.2 44.45,33.02 99.06,33.02 99.06,22.86 43.18,22.86 J17.4
N$20
  Bottom 0.61: R29.2 39.37,31.75 97.79,31.75 97.79,24.13 40.64,24.13 J17.3
N$21
  Bottom 0.61: D3.A 137.16,67.5 U$2.P$3
N$22
  Bottom 0.61: D4.A 137.16,44.64 U$3.P$3
N$25
  Bottom 0.61: LED3.A 124.46,94.93 R39.1
N$42
  Bottom 0.61: LED4.A 124.46,89.85 R40.1
N$55  (via drill 3.81)
  other vias: 3.81,101.6
N$56  (via drill 3.81)
  other vias: 154.94,5.08
N$57  (via drill 3.81)
  other vias: 154.94,101.6
N$58  (via drill 3.81)
  other vias: 3.81,5.08
RESET  (via drill 0.35)
  Top 0.61: v31.12,13.97 v34.93,13.97
  Bottom 0.61: PCB1.RESET 90.17,25.4 38.1,25.4 38.1,13.97 v34.93,13.97 | RESET.1 26.57,10.79 | RESET.1 31.12,10.85 v31.12,13.97 | 20.32,10.85 RESET.2 | 20.32,10.85 RESET.1 | R5.1 20.32,10.85
SCL
  Bottom 0.61: R49.2 PCB1.21 36.83,73.03 113.03,73.03 113.03,76.84 IC6.6
SCL1
  Bottom 0.61: 104.14,77.47 PCB1.SCL1 104.39,89.28 J4.2
SDA
  Bottom 0.61: R50.2 PCB1.20 39.37,74.29 57.15,74.29 57.79,74.29 109.7,74.29 IC6.5
SDA1
  Bottom 0.61: PCB1.SDA1 101.85,89.28 J4.3

### Text on the board
Dimension: 6v | 5v | KOMUNIKASI | SDA | SCL | GND | 6v | gnd | gnd | 3.3v | 16 / TX | 3.3v | 17 / RX | 12v | gnd | 25 | 23 | 19 | 18 | 15 | 14 | 14 | 6 | 27 | 13 | 12 | 11 | 10 | 9 | 7 | 29 | SCL | SDA | 5v | 8 | 31 | GND | gnd | 9 | 33 | 10 | 35 | 3.3v | 11 | 37 | 12 | 39 | gnd | 13 | 41 | 5v | gnd | 12v | HEROES 2018 JUARA NASIONAL / بِسْــــــــــــــــــمِ اللهِ الرَّحْمَنِ الرَّحِيْمِ | gnd | gnd | 12v | 52 | 50 | gnd | 12v | 48 | 46 | gnd | 12v | 44 | 42 | gnd | 12v | 40 | 38 | gnd | 5V | 36 | 34 | gnd | 5V | 32 | 30 | gnd | 5V | 28 | 26 | gnd | 5V | 24 | 22